# EAGLE board hawks_rov_1_controller_v2 (EAGLE 8.6.1), part 1 of 2
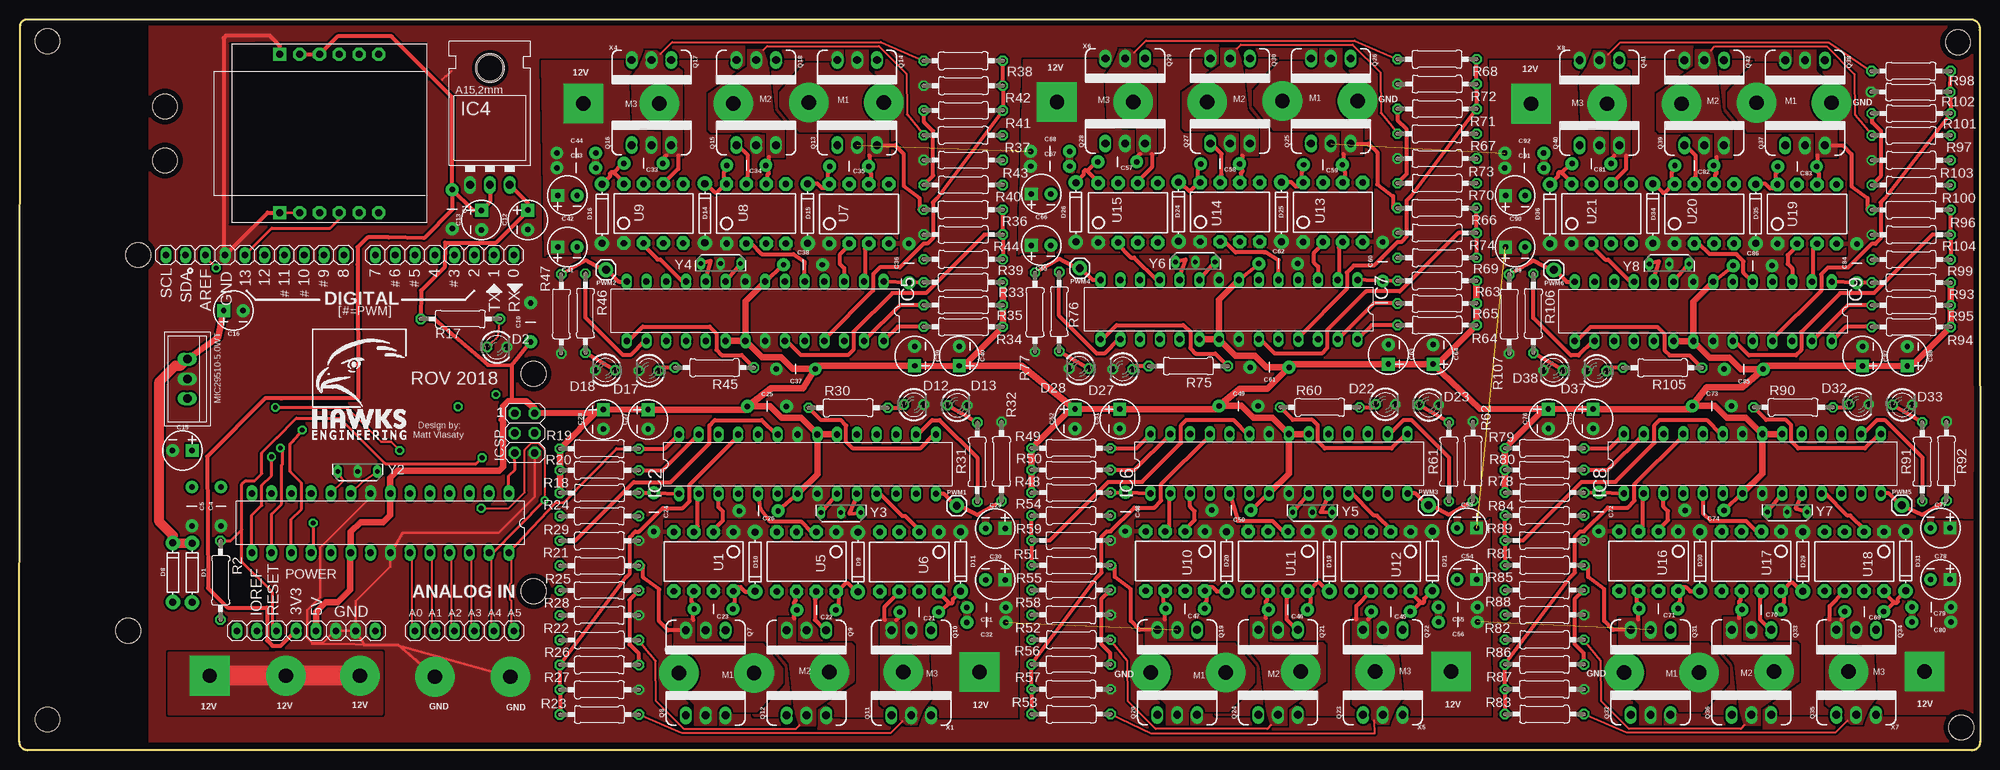
[diagram p7: board, top side]
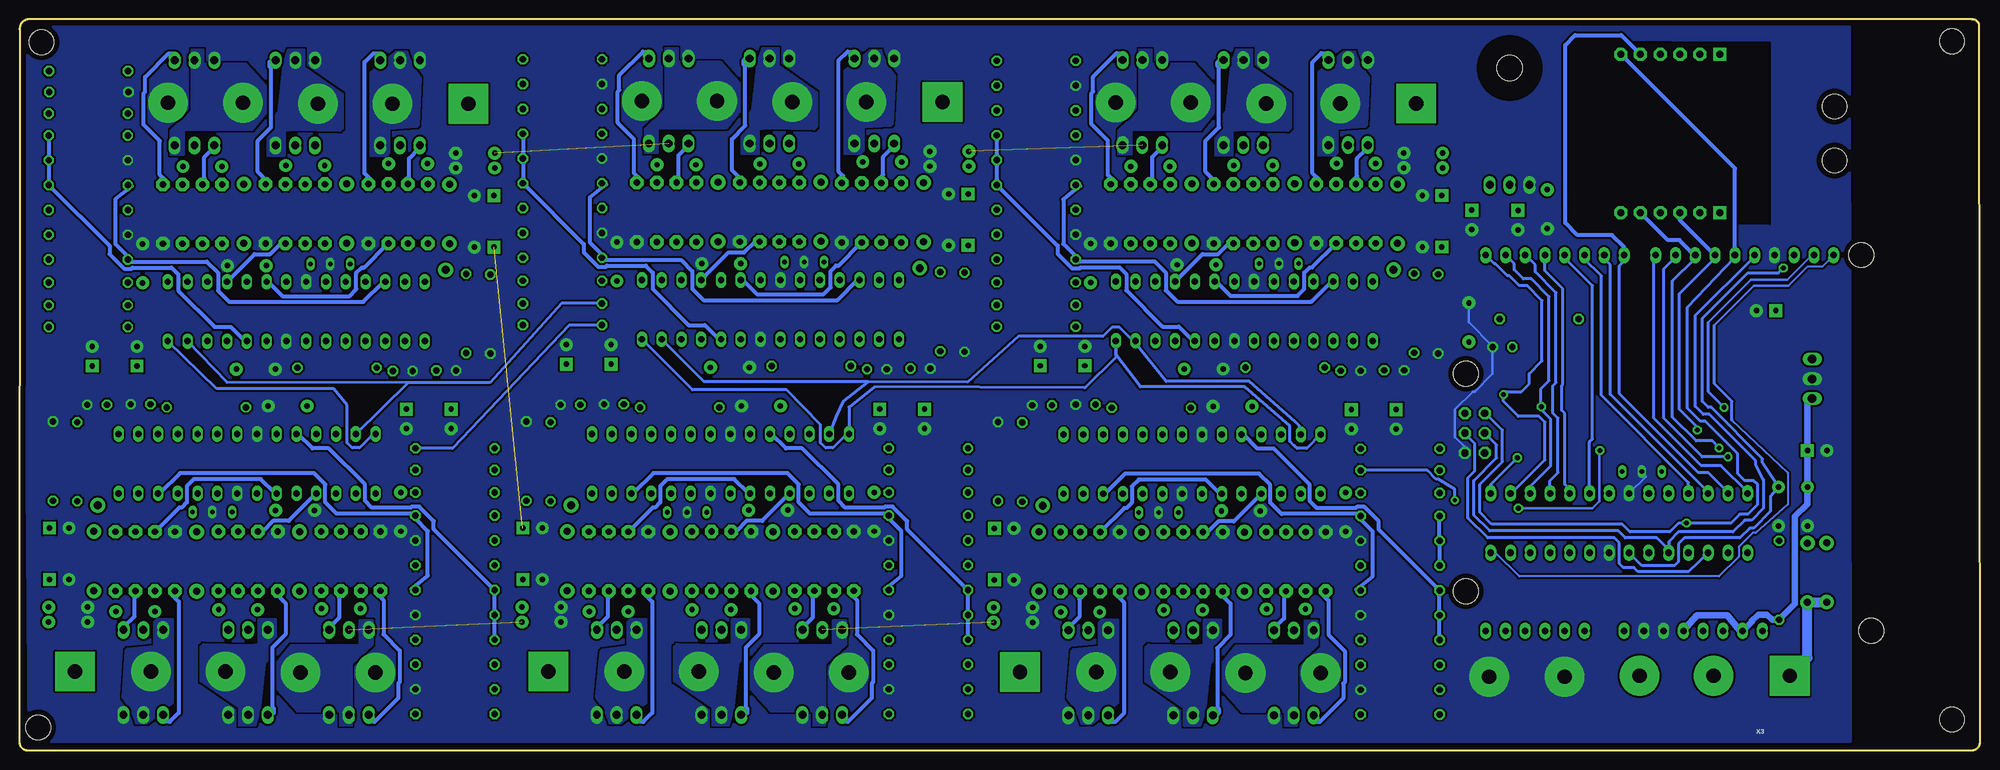
[diagram p8: board, bottom side, seen from below]

Size 251.84 x 93.86 mm. Coordinates in mm from the lower left corner, seen from the top.
Outline: 250.84,93.85 arc-90 251.79,92.47
Outline: 251.84,1.1 arc-90 250.84,0
Outline: 1,0 arc-90 0,1.1
Outline: 0.1,93.11 arc-90 1,93.85
Outline: 1,93.85 250.84,93.85
Outline: 250.84,93.85 arc-90 251.79,92.47
Outline: 251.79,92.47 251.84,1.1
Outline: 251.84,1.1 arc-90 250.84,0
Outline: 250.84,0 1,0
Outline: 1,0 arc-90 0,1.1
Outline: 0,1.1 0.1,93.11
Outline: 0.1,93.11 arc-90 1,93.85
Copper layers (1*16): Top 0.035mm / dielectric 1.5mm / Bottom 0.035mm
Design rules "default *": minimum track width 10mil, minimum drill 22mil, track to track 10mil, track to pad 10mil, pad to pad 10mil, via to via 12mil, smd to smd 8mil, copper to edge 26mil, drill to drill 6mil, minimum pad ring 10mil, minimum via ring 10mil, stop-mask expansion 1mil, vias tented up to drill 30mil, thermal gap 10mil
Net classes: 0 default: width 0.254 mm, clearance 0.254 mm; 1 power: width 0.61 mm, drill 0.61 mm, clearance 0.254 mm; 2 gnd: width 0.305 mm, drill 0.559 mm, clearance 0.254 mm; 3 usbvcc: width 0.508 mm, drill 0.61 mm, clearance 0.254 mm; 4 aref: width 0.406 mm, drill 0.61 mm, clearance 0.254 mm
Holes 3.2 mm at 66.04,48.36 66.04,20.42 13.97,15.34 15.24,63.6 3.59,91.05 3.59,3.96 249.01,90.92 249.44,2.92 18.69,75.74 18.69,82.68
vRestrict: area 1.2,21.4 to 2.9,26.4; area 3.7,22.8 to 5.4,26.4; area 6.8,22.6 to 7.9,26.1; area 9.3,22.6 to 10.4,26.1; area 11.8,22.6 to 13,26.1; area 14.4,22.6 to 15.5,26.1; area 17,24.5 to 18.2,26.1; area 18.6,22.4 to 25.9,24.2; area 38.6,21.5 to 40,24; area 41.2,21.5 to 42.6,24; area 39.6,13.1 to 43.1,14.5; area -21.1,-0.9 to -19.7,7.4; 222 more areas

## Footprints (pad centres in the part's own frame; a part is rotated, then mirrored left to right if it is on the bottom)
1X06 = drill 0.85 pad 1.422 long: 1 -6.35,0; 2 -3.81,0; 3 -1.27,0; 4 1.27,0; 5 3.81,0; 6 6.35,0
CAP-PTH-5MM = drill 0.7 pad 1.651: 1 -2.5,0; 2 2.5,0
CPOL-RADIAL-2.5MM-5MM = drill 0.7 pad 1.651 square: 1 1.25,0 | drill 0.7 pad 1.651: 2 -1.25,0
DIODE-1N4148-KIT = drill 0.9 pad 1.88: A -3.81,0; C 3.81,0
LED3MM = drill 0.813 octagon: A -1.27,0; K 1.27,0
WIZ820IO = drill 0.9 pad 1.676 square: J1.1 -10.16,6.35; J2.1 10.16,6.35 | drill 0.9 pad 1.676 octagon: J1.2 -10.16,3.81; J1.3 -10.16,1.27; J1.4 -10.16,-1.27; J1.5 -10.16,-3.81; J1.6 -10.16,-6.35; J2.2 10.16,3.81; J2.3 10.16,1.27; J2.4 10.16,-1.27; J2.5 10.16,-3.81; J2.6 10.16,-6.35
DIL28-3 = drill 0.813 long: 1 -16.51,-3.81; 2 -13.97,-3.81; 3 -11.43,-3.81; 4 -8.89,-3.81; 5 -6.35,-3.81; 6 -3.81,-3.81; 7 -1.27,-3.81; 8 1.27,-3.81; 9 3.81,-3.81; 10 6.35,-3.81; 11 8.89,-3.81; 12 11.43,-3.81; 13 13.97,-3.81; 14 16.51,-3.81; 15 16.51,3.81; 16 13.97,3.81; 17 11.43,3.81; 18 8.89,3.81; 19 6.35,3.81; 20 3.81,3.81; 21 1.27,3.81; 22 -1.27,3.81; 23 -3.81,3.81; 24 -6.35,3.81; 25 -8.89,3.81; 26 -11.43,3.81; 27 -13.97,3.81; 28 -16.51,3.81
TO220L1 = drill 1.016 long: 1 -2.54,-3.81; 2 0,-3.81; 3 2.54,-3.81 | hole 3.302: 0,11.176
2X03 = drill 0.95 pad 1.55 octagon: 1 -2.54,-1.27; 2 -2.54,1.27; 3 0,-1.27; 4 0,1.27; 5 2.54,-1.27; 6 2.54,1.27
1X10 = drill 0.85 pad 1.422 long: 1 -11.43,0; 2 -8.89,0; 3 -6.35,0; 4 -3.81,0; 5 -1.27,0; 6 1.27,0; 7 3.81,0; 8 6.35,0; 9 8.89,0; 10 11.43,0
1X08 = drill 0.85 pad 1.422 long: 1 -8.89,0; 2 -6.35,0; 3 -3.81,0; 4 -1.27,0; 5 1.27,0; 6 3.81,0; 7 6.35,0; 8 8.89,0
TO-220-STANDING = drill 1.1 long: 1 -2.54,0; 2 0,0; 3 2.54,0
1X01 = drill 1.016 pad 1.88: 1 0,0
TO220V = drill 1.016 long: 1 -2.54,0; 2 0,0; 3 2.54,0
0207/10 = drill 0.813 octagon: 1 -5.08,0; 2 5.08,0
DIP-08 = drill 0.813 pad 1.727 octagon: 1 -3.81,-3.81; 2 -1.27,-3.81; 3 1.27,-3.81; 4 3.81,-3.81; 5 3.81,3.81; 6 1.27,3.81; 7 -1.27,3.81; 8 -3.81,3.81
SCREWTERMINAL-3.5MM-5 = drill 1.854 pad 5.08 square: 12V 0.254,-2.286 | drill 1.854 pad 5.08: GND 38.862,-2.159; M1 29.21,-2.159; M2 19.558,-2.286; M3 10.033,-2.286
SIP3-UA = drill 0.6 pad 0.7 long: 1 -2.54,0; 2 0,0; 3 2.54,0
DIL28-3' = drill 0.85 pad 1.422 long: 1 -16.51,-3.81; 2 -13.97,-3.81; 3 -11.43,-3.81; 4 -8.89,-3.81; 5 -6.35,-3.81; 6 -3.81,-3.81; 7 -1.27,-3.81; 8 1.27,-3.81; 9 3.81,-3.81; 10 6.35,-3.81; 11 8.89,-3.81; 12 11.43,-3.81; 13 13.97,-3.81; 14 16.51,-3.81; 15 16.51,3.81; 16 13.97,3.81; 17 11.43,3.81; 18 8.89,3.81; 19 6.35,3.81; 20 3.81,3.81; 21 1.27,3.81; 22 -1.27,3.81; 23 -3.81,3.81; 24 -6.35,3.81; 25 -8.89,3.81; 26 -11.43,3.81; 27 -13.97,3.81; 28 -16.51,3.81

## Placement (x,y rotation side)
AD  6x1F-H8.5  [1X06]  57.15,15.34 0 top
C1  .1uF  [CAP-PTH-5MM]  55.6,69.49 270 top
C4  .1uF  [CAP-PTH-5MM]  25.88,31.32 90 top
C5  .1uF  [CAP-PTH-5MM]  22.15,31.32 270 top
C10  .1uF  [CAP-PTH-5MM]  65.66,54.97 90 top
C12  100uF  [CPOL-RADIAL-2.5MM-5MM]  65.3,68.12 90 top
C13  100uF  [CPOL-RADIAL-2.5MM-5MM]  59.35,68.1 90 top
C15  100uF  [CPOL-RADIAL-2.5MM-5MM]  20.93,38.51 0 top
C16  100uF  [CPOL-RADIAL-2.5MM-5MM]  27.48,56.46 180 top
C21  47NF  [CAP-PTH-5MM]  115.57,17.77 180 top
C22  47NF  [CAP-PTH-5MM]  102.36,18.02 180 top
C23  47NF  [CAP-PTH-5MM]  89.15,18.15 180 top
C24  .1uF  [CAP-PTH-5MM]  81.48,30.58 270 top
C25  .1uF  [CAP-PTH-5MM]  96.01,44.17 0 top
C26  .1uF  [CAP-PTH-5MM]  94.95,30.76 180 top
C27  100uF  [CPOL-RADIAL-2.5MM-5MM]  80.75,42.51 90 top
C28  100uF  [CPOL-RADIAL-2.5MM-5MM]  75.01,42.51 90 top
C29  100uF  [CPOL-RADIAL-2.5MM-5MM]  125.35,28.5 0 top
C30  100uF  [CPOL-RADIAL-2.5MM-5MM]  125.35,21.89 0 top
C31  .1uF  [CAP-PTH-5MM]  124.21,18.34 180 top
C32  .1uF  [CAP-PTH-5MM]  124.21,16.43 180 top
C33  47NF  [CAP-PTH-5MM]  80.16,75.37 0 top
C34  47NF  [CAP-PTH-5MM]  93.37,75.12 0 top
C35  47NF  [CAP-PTH-5MM]  106.58,74.99 0 top
C36  .1uF  [CAP-PTH-5MM]  114.25,62.56 90 top
C37  .1uF  [CAP-PTH-5MM]  99.72,48.97 180 top
C38  .1uF  [CAP-PTH-5MM]  100.65,62.36 0 top
C39  100uF  [CPOL-RADIAL-2.5MM-5MM]  114.99,50.63 270 top
C40  100uF  [CPOL-RADIAL-2.5MM-5MM]  120.73,50.63 270 top
C41  100uF  [CPOL-RADIAL-2.5MM-5MM]  70.38,64.64 180 top
C42  100uF  [CPOL-RADIAL-2.5MM-5MM]  70.38,71.25 180 top
C43  .1uF  [CAP-PTH-5MM]  71.53,74.8 0 top
C44  .1uF  [CAP-PTH-5MM]  71.53,76.71 0 top
C45  47NF  [CAP-PTH-5MM]  176.15,17.82 180 top
C46  47NF  [CAP-PTH-5MM]  162.94,18.07 180 top
C47  47NF  [CAP-PTH-5MM]  149.73,18.2 180 top
C48  .1uF  [CAP-PTH-5MM]  142.06,30.63 270 top
C49  .1uF  [CAP-PTH-5MM]  156.59,44.22 0 top
C50  .1uF  [CAP-PTH-5MM]  155.66,30.84 180 top
C51  100uF  [CPOL-RADIAL-2.5MM-5MM]  141.33,42.56 90 top
C52  100uF  [CPOL-RADIAL-2.5MM-5MM]  135.59,42.56 90 top
C53  100uF  [CPOL-RADIAL-2.5MM-5MM]  185.93,28.55 0 top
C54  100uF  [CPOL-RADIAL-2.5MM-5MM]  185.93,21.95 0 top
C55  .1uF  [CAP-PTH-5MM]  184.79,18.39 180 top
C56  .1uF  [CAP-PTH-5MM]  184.79,16.48 180 top
C57  47NF  [CAP-PTH-5MM]  141.02,75.58 0 top
C58  47NF  [CAP-PTH-5MM]  154.23,75.32 0 top
C59  47NF  [CAP-PTH-5MM]  167.44,75.2 0 top
C60  .1uF  [CAP-PTH-5MM]  175.11,62.76 90 top
C61  .1uF  [CAP-PTH-5MM]  160.58,49.17 180 top
C62  .1uF  [CAP-PTH-5MM]  161.7,62.5 0 top
C63  100uF  [CPOL-RADIAL-2.5MM-5MM]  175.84,50.84 270 top
C64  100uF  [CPOL-RADIAL-2.5MM-5MM]  181.58,50.84 270 top
C65  100uF  [CPOL-RADIAL-2.5MM-5MM]  131.24,64.85 180 top
C66  100uF  [CPOL-RADIAL-2.5MM-5MM]  131.24,71.45 180 top
C67  .1uF  [CAP-PTH-5MM]  132.39,75.01 0 top
C68  .1uF  [CAP-PTH-5MM]  132.39,76.91 0 top
C69  47NF  [CAP-PTH-5MM]  236.96,17.82 180 top
C70  47NF  [CAP-PTH-5MM]  223.75,18.07 180 top
C71  47NF  [CAP-PTH-5MM]  210.54,18.2 180 top
C72  .1uF  [CAP-PTH-5MM]  202.87,30.63 270 top
C73  .1uF  [CAP-PTH-5MM]  217.4,44.22 0 top
C74  .1uF  [CAP-PTH-5MM]  216.43,30.82 180 top
C75  100uF  [CPOL-RADIAL-2.5MM-5MM]  202.13,42.56 90 top
C76  100uF  [CPOL-RADIAL-2.5MM-5MM]  196.39,42.56 90 top
C77  100uF  [CPOL-RADIAL-2.5MM-5MM]  246.74,28.55 0 top
C78  100uF  [CPOL-RADIAL-2.5MM-5MM]  246.74,21.95 0 top
C79  .1uF  [CAP-PTH-5MM]  245.59,18.39 180 top
C80  .1uF  [CAP-PTH-5MM]  245.59,16.48 180 top
C81  47NF  [CAP-PTH-5MM]  201.93,75.35 0 top
C82  47NF  [CAP-PTH-5MM]  215.14,75.1 0 top
C83  47NF  [CAP-PTH-5MM]  228.35,74.97 0 top
C84  .1uF  [CAP-PTH-5MM]  236.02,62.53 90 top
C85  .1uF  [CAP-PTH-5MM]  221.49,48.95 180 top
C86  .1uF  [CAP-PTH-5MM]  222.63,62.24 0 top
C87  100uF  [CPOL-RADIAL-2.5MM-5MM]  236.75,50.61 270 top
C88  100uF  [CPOL-RADIAL-2.5MM-5MM]  242.49,50.61 270 top
C89  100uF  [CPOL-RADIAL-2.5MM-5MM]  192.15,64.62 180 top
C90  100uF  [CPOL-RADIAL-2.5MM-5MM]  192.15,71.22 180 top
C91  .1uF  [CAP-PTH-5MM]  193.29,74.78 0 top
C92  .1uF  [CAP-PTH-5MM]  193.29,76.68 0 top
D1  1N4148  [DIODE-1N4148-KIT]  22.17,22.81 90 top
D2  Green  [LED3MM]  61.34,51.79 0 top
D8  1N4148  [DIODE-1N4148-KIT]  19.71,22.83 90 top
D9  1N4148  [DIODE-1N4148-KIT]  107.7,24.18 270 top
D10  1N4148  [DIODE-1N4148-KIT]  94.49,24.21 270 top
D11  1N4148  [DIODE-1N4148-KIT]  120.9,24.24 270 top
D12  Red  [LED3MM]  114.88,44.4 0 top
D13  Blue  [LED3MM]  120.47,44.32 0 top
D14  1N4148  [DIODE-1N4148-KIT]  88.04,68.96 90 top
D15  1N4148  [DIODE-1N4148-KIT]  101.24,68.93 90 top
D16  1N4148  [DIODE-1N4148-KIT]  74.83,68.9 90 top
D17  Red  [LED3MM]  80.85,48.74 180 top
D18  Blue  [LED3MM]  75.26,48.82 180 top
D19  1N4148  [DIODE-1N4148-KIT]  168.28,24.23 270 top
D20  1N4148  [DIODE-1N4148-KIT]  155.07,24.26 270 top
D21  1N4148  [DIODE-1N4148-KIT]  181.48,24.29 270 top
D22  Red  [LED3MM]  175.46,44.45 0 top
D23  Blue  [LED3MM]  181.05,44.37 0 top
D24  1N4148  [DIODE-1N4148-KIT]  148.9,69.16 90 top
D25  1N4148  [DIODE-1N4148-KIT]  162.1,69.13 90 top
D26  1N4148  [DIODE-1N4148-KIT]  135.69,69.1 90 top
D27  Red  [LED3MM]  141.71,48.95 180 top
D28  Blue  [LED3MM]  136.12,49.02 180 top
D29  1N4148  [DIODE-1N4148-KIT]  229.08,24.23 270 top
D30  1N4148  [DIODE-1N4148-KIT]  215.87,24.26 270 top
D31  1N4148  [DIODE-1N4148-KIT]  242.29,24.29 270 top
D32  Red  [LED3MM]  236.27,44.45 0 top
D33  Blue  [LED3MM]  241.86,44.37 0 top
D34  1N4148  [DIODE-1N4148-KIT]  209.8,68.94 90 top
D35  1N4148  [DIODE-1N4148-KIT]  223.01,68.91 90 top
D36  1N4148  [DIODE-1N4148-KIT]  196.6,68.87 90 top
D37  Red  [LED3MM]  202.62,48.72 180 top
D38  Blue  [LED3MM]  197.03,48.79 180 top
IC1  WIZ820io  [WIZ820IO]  39.8,79.22 90 top
IC2  MEGA8-P  [DIL28-3]  101.22,36.75 0 top
IC4  LD117AV33  [TO220L1]  60.43,76.44 0 top
IC5  MEGA8-P  [DIL28-3]  94.51,56.39 180 top
IC6  MEGA8-P  [DIL28-3]  161.8,36.8 0 top
IC7  MEGA8-P  [DIL28-3]  155.37,56.59 180 top
IC8  MEGA8-P  [DIL28-3]  222.61,36.8 0 top
IC9  MEGA8-P  [DIL28-3]  216.28,56.36 180 top
ICSP  3x2 M  [2X03]  64.9,40.74 270 top
IOH  10x1F-H8.5  [1X10]  30.23,63.6 180 top
IOL  8x1F-H8.5  [1X08]  54.61,63.6 180 top
MIC29510-5.0WT  5.0V  [TO-220-STANDING]  21.56,47.7 270 top
POWER  8x1F-H8.5  [1X08]  36.83,15.34 0 top
PWM1  [1X01]  120.4,31.42 0 top
PWM2  [1X01]  75.34,61.72 180 top
PWM3  [1X01]  180.98,31.47 0 top
PWM4  [1X01]  136.2,61.93 180 top
PWM5  [1X01]  241.78,31.47 0 top
PWM6  [1X01]  197.1,61.7 180 top
Q7  IRLI3705  [TO220V]  88.14,15.42 180 top
Q8  IRLI3705  [TO220V]  88.14,4.5 0 top
Q9  IRLI3705  [TO220V]  101.09,15.42 180 top
Q10  IRLI3705  [TO220V]  114.55,15.42 180 top
Q11  IRLI3705  [TO220V]  114.55,4.5 0 top
Q12  IRLI3705  [TO220V]  101.09,4.5 0 top
Q13  IRLI3705  [TO220V]  107.59,77.72 0 top
Q14  IRLI3705  [TO220V]  107.59,88.65 180 top
Q15  IRLI3705  [TO220V]  94.64,77.72 0 top
Q16  IRLI3705  [TO220V]  81.18,77.72 0 top
Q17  IRLI3705  [TO220V]  81.18,88.65 180 top
Q18  IRLI3705  [TO220V]  94.64,88.65 180 top
Q19  IRLI3705  [TO220V]  148.72,15.47 180 top
Q20  IRLI3705  [TO220V]  148.72,4.55 0 top
Q21  IRLI3705  [TO220V]  161.67,15.47 180 top
Q22  IRLI3705  [TO220V]  175.13,15.47 180 top
Q23  IRLI3705  [TO220V]  175.13,4.55 0 top
Q24  IRLI3705  [TO220V]  161.67,4.55 0 top
Q25  IRLI3705  [TO220V]  168.45,77.93 0 top
Q26  IRLI3705  [TO220V]  168.45,88.85 180 top
Q27  IRLI3705  [TO220V]  155.5,77.93 0 top
Q28  IRLI3705  [TO220V]  142.04,77.93 0 top
Q29  IRLI3705  [TO220V]  142.04,88.85 180 top
Q30  IRLI3705  [TO220V]  155.5,88.85 180 top
Q31  IRLI3705  [TO220V]  209.52,15.47 180 top
Q32  IRLI3705  [TO220V]  209.52,4.55 0 top
Q33  IRLI3705  [TO220V]  222.48,15.47 180 top
Q34  IRLI3705  [TO220V]  235.94,15.47 180 top
Q35  IRLI3705  [TO220V]  235.94,4.55 0 top
Q36  IRLI3705  [TO220V]  222.48,4.55 0 top
Q37  IRLI3705  [TO220V]  229.36,77.7 0 top
Q38  IRLI3705  [TO220V]  229.36,88.62 180 top
Q39  IRLI3705  [TO220V]  216.41,77.7 0 top
Q40  IRLI3705  [TO220V]  202.95,77.7 0 top
Q41  IRLI3705  [TO220V]  202.95,88.62 180 top
Q42  IRLI3705  [TO220V]  216.41,88.62 180 top
R2  10K  [0207/10]  25.83,21.84 270 top
R17  1K  [0207/10]  56.64,55.4 0 top
R18  10K  [0207/10]  74.5,33.05 180 top
R19  10K  [0207/10]  74.5,38.74 0 top
R20  10K  [0207/10]  74.5,35.95 0 top
R21  47K  [0207/10]  74.5,23.72 180 top
R22  47K  [0207/10]  74.5,14.16 180 top
R23  47K  [0207/10]  74.5,4.6 180 top
R24  47K  [0207/10]  74.5,30.09 0 top
R25  47K  [0207/10]  74.5,20.53 0 top
R26  47K  [0207/10]  74.5,10.97 0 top
R27  4.7K  [0207/10]  74.5,7.78 0 top
R28  4.7K  [0207/10]  74.5,17.34 0 top
R29  4.7K  [0207/10]  74.5,26.9 0 top
R30  4.7K  [0207/10]  106.45,43.99 0 top
R31  1K  [0207/10]  123.04,37.01 90 top
R32  47K  [0207/10]  126.14,37.08 90 top
R33  10K  [0207/10]  121.23,60.1 0 top
R34  10K  [0207/10]  121.23,54.4 180 top
R35  10K  [0207/10]  121.23,57.19 180 top
R36  47K  [0207/10]  121.23,69.43 0 top
R37  47K  [0207/10]  121.23,78.98 0 top
R38  47K  [0207/10]  121.23,88.54 0 top
R39  47K  [0207/10]  121.23,63.05 180 top
R40  47K  [0207/10]  121.23,72.61 180 top
R41  47K  [0207/10]  121.23,82.17 180 top
R42  4.7K  [0207/10]  121.23,85.36 180 top
R43  4.7K  [0207/10]  121.23,75.8 180 top
R44  4.7K  [0207/10]  121.23,66.24 180 top
R45  4.7K  [0207/10]  89.28,49.15 180 top
R46  1K  [0207/10]  72.7,56.13 270 top
R47  47K  [0207/10]  69.6,56.06 270 top
R48  10K  [0207/10]  135.08,33.1 180 top
R49  10K  [0207/10]  135.08,38.79 0 top
R50  10K  [0207/10]  135.08,36.01 0 top
R51  47K  [0207/10]  135.08,23.77 180 top
R52  47K  [0207/10]  135.08,14.21 180 top
R53  47K  [0207/10]  135.08,4.65 180 top
R54  47K  [0207/10]  135.08,30.14 0 top
R55  47K  [0207/10]  135.08,20.58 0 top
R56  47K  [0207/10]  135.08,11.02 0 top
R57  4.7K  [0207/10]  135.08,7.83 0 top
R58  4.7K  [0207/10]  135.08,17.39 0 top
R59  4.7K  [0207/10]  135.08,26.95 0 top
R60  4.7K  [0207/10]  167.03,44.04 0 top
R61  1K  [0207/10]  183.62,37.06 90 top
R62  47K  [0207/10]  186.72,37.13 90 top
R63  10K  [0207/10]  182.09,60.3 0 top
R64  10K  [0207/10]  182.09,54.61 180 top
R65  10K  [0207/10]  182.09,57.39 180 top
R66  47K  [0207/10]  182.09,69.63 0 top
R67  47K  [0207/10]  182.09,79.19 0 top
R68  47K  [0207/10]  182.09,88.75 0 top
R69  47K  [0207/10]  182.09,63.26 180 top
R70  47K  [0207/10]  182.09,72.81 180 top
R71  47K  [0207/10]  182.09,82.37 180 top
R72  4.7K  [0207/10]  182.09,85.56 180 top
R73  4.7K  [0207/10]  182.09,76 180 top
R74  4.7K  [0207/10]  182.09,66.44 180 top
R75  4.7K  [0207/10]  150.14,49.35 180 top
R76  1K  [0207/10]  133.55,56.34 270 top
R77  47K  [0207/10]  130.45,56.26 270 top
R78  10K  [0207/10]  195.89,33.1 180 top
R79  10K  [0207/10]  195.89,38.79 0 top
R80  10K  [0207/10]  195.89,36.01 0 top
R81  47K  [0207/10]  195.89,23.77 180 top
R82  47K  [0207/10]  195.89,14.21 180 top
R83  47K  [0207/10]  195.89,4.65 180 top
R84  47K  [0207/10]  195.89,30.14 0 top
R85  47K  [0207/10]  195.89,20.58 0 top
R86  47K  [0207/10]  195.89,11.02 0 top
R87  4.7K  [0207/10]  195.89,7.83 0 top
R88  4.7K  [0207/10]  195.89,17.39 0 top
R89  4.7K  [0207/10]  195.89,26.95 0 top
R90  4.7K  [0207/10]  227.84,44.04 0 top
R91  1K  [0207/10]  244.42,37.06 90 top
R92  47K  [0207/10]  247.52,37.13 90 top
R93  10K  [0207/10]  243,60.07 0 top
R94  10K  [0207/10]  243,54.38 180 top
R95  10K  [0207/10]  243,57.16 180 top
R96  47K  [0207/10]  243,69.4 0 top
R97  47K  [0207/10]  243,78.96 0 top
R98  47K  [0207/10]  242.98,87.22 0 top
R99  47K  [0207/10]  243,63.03 180 top
R100  47K  [0207/10]  243,72.59 180 top
R101  47K  [0207/10]  243,81.79 180 top
R102  4.7K  [0207/10]  242.93,84.55 180 top
R103  4.7K  [0207/10]  243,75.77 180 top
R104  4.7K  [0207/10]  243,66.21 180 top
R105  4.7K  [0207/10]  211.05,49.12 180 top
R106  1K  [0207/10]  194.46,56.11 270 top
R107  47K  [0207/10]  191.36,56.03 270 top
U1  [DIP-08]  87.88,24.25 180 top
U5  [DIP-08]  101.09,24.23 180 top
U6  [DIP-08]  114.3,24.21 180 top
U7  [DIP-08]  107.85,68.89 0 top
U8  [DIP-08]  94.64,68.92 0 top
U9  [DIP-08]  81.43,68.94 0 top
U10  [DIP-08]  148.46,24.3 180 top
U11  [DIP-08]  161.67,24.28 180 top
U12  [DIP-08]  174.88,24.26 180 top
U13  [DIP-08]  168.71,69.1 0 top
U14  [DIP-08]  155.5,69.12 0 top
U15  [DIP-08]  142.39,69.04 0 top
U16  [DIP-08]  209.27,24.3 180 top
U17  [DIP-08]  222.48,24.28 180 top
U18  [DIP-08]  235.69,24.26 180 top
U19  [DIP-08]  229.62,68.87 0 top
U20  [DIP-08]  216.41,68.89 0 top
U21  [DIP-08]  203.2,68.91 0 top
U$1  [IMAGE1#JPEG]  43.64,47 0 top
X1  NC6-108-05  [SCREWTERMINAL-3.5MM-5]  123.57,7.8 180 top
X3  NC6-108-05  [SCREWTERMINAL-3.5MM-5]  24.18,7.29 180 bottom
X4  NC6-108-05  [SCREWTERMINAL-3.5MM-5]  72.16,85.34 0 top
X5  NC6-108-05  [SCREWTERMINAL-3.5MM-5]  184.15,7.85 180 top
X6  NC6-108-05  [SCREWTERMINAL-3.5MM-5]  133.02,85.55 0 top
X7  NC6-108-05  [SCREWTERMINAL-3.5MM-5]  244.96,7.85 180 top
X8  NC6-108-05  [SCREWTERMINAL-3.5MM-5]  193.93,85.32 0 top
Y2  [SIP3-UA]  43.43,35.79 0 top
Y3  [SIP3-UA]  105.51,30.53 0 top
Y4  [SIP3-UA]  90.07,62.5 180 top
Y5  [SIP3-UA]  166.09,30.58 0 top
Y6  [SIP3-UA]  151.03,62.71 180 top
Y7  [SIP3-UA]  227.06,30.61 0 top
Y8  [SIP3-UA]  211.91,62.46 180 top
ZU4  ATMEGA328P-PU  [DIL28-3']  46.36,29.18 180 top